# Altium schematic sheet Probe-Scope Power v1.0.SchDoc: Probe-Scope: Power
size Letter; CompanyName: Probe-Scope; Organization: Probe-Scope; Address1: Probe-Scope: Unified USB; Address2: Oscilloscope Probe; Address3: ©2019 M. Omo, J. Rowley,; Address4: K. Hall, released under the; SheetNumber: 6; PageSetup: Record=PageOptions|CenterHorizontal=True|CenterVertical=True|PrintScale=0.96|XCorrection=1.00|YCorrection=1.00|PrintKind=1|BorderSize=5000000|LeftOffset=0|BottomOffset=0|Orientation=2|PaperLength=1000|PaperWidth=1000|Scale=100|PaperSource=7|PrintQuality=-4|MediaType=1|DitherType=10|PaperKind=11x17|PrintScaleMode=1; License: CERN OHL v1.2
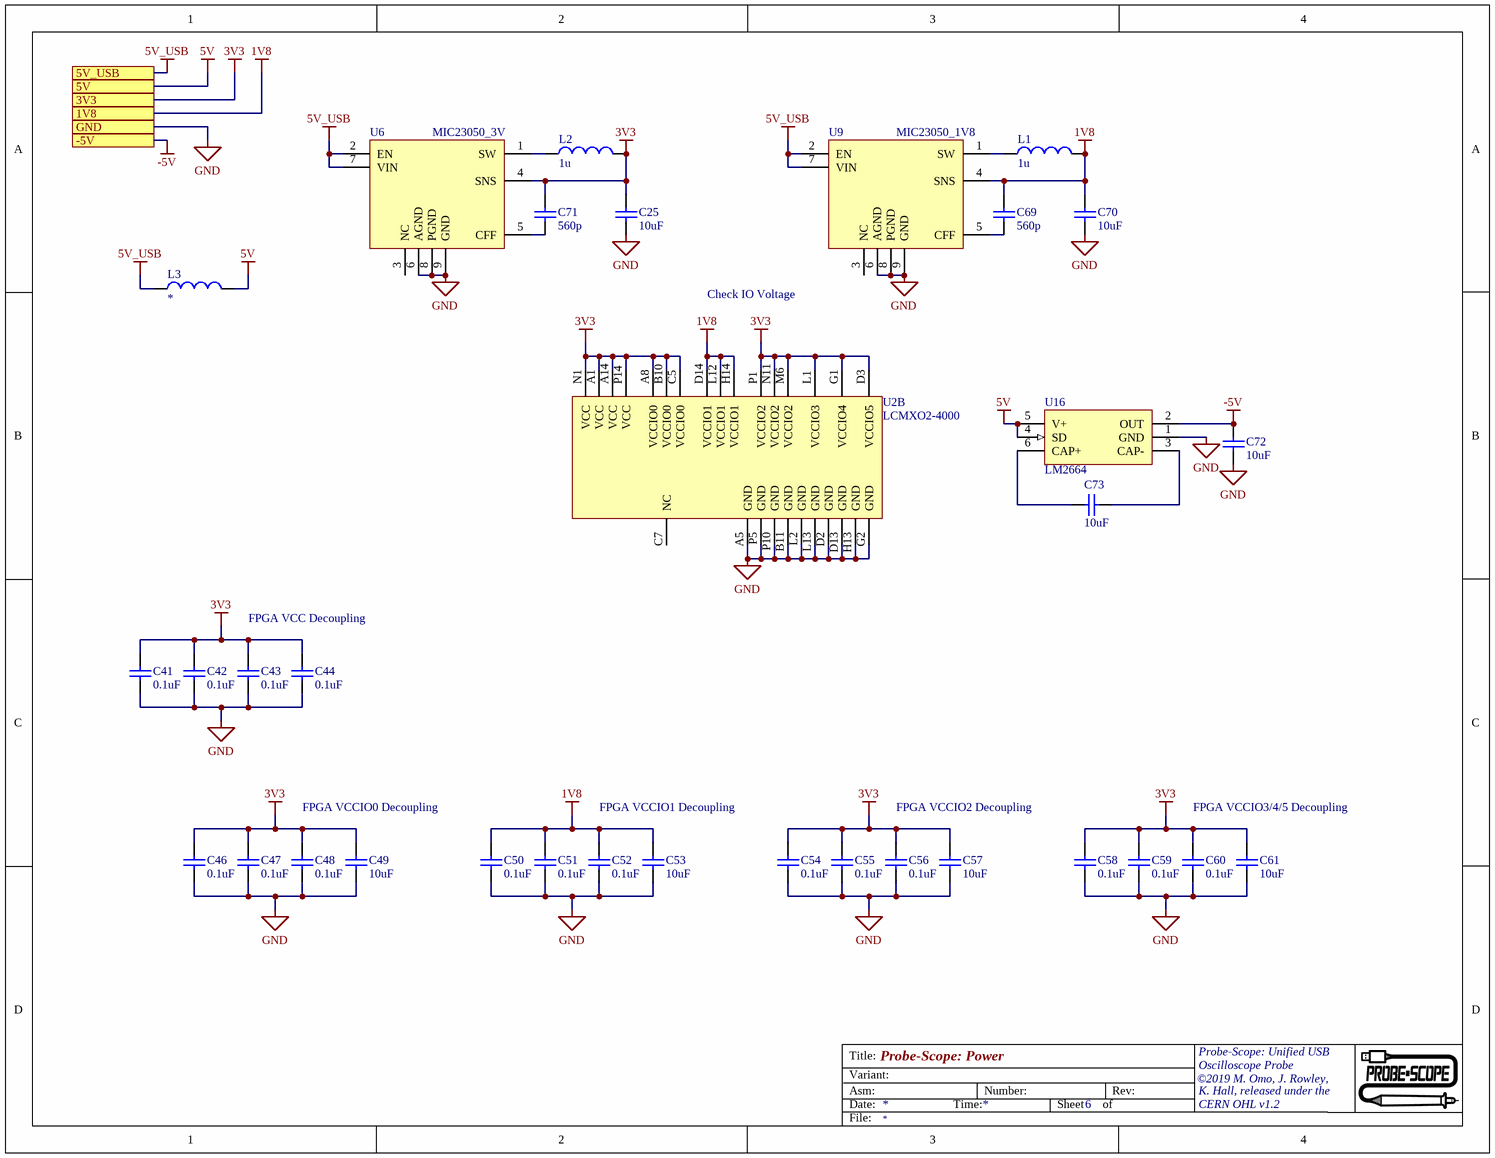
[diagram p0: Probe-Scope Power v1.0.SchDoc]

## Parts
C25  value 10uF  [0603(1608)]  (hidden comment: 25V)
C41  value 0.1uF  [0402(1005)]  (hidden comment: 6.3V)
C42  value 0.1uF  [0402(1005)]  (hidden comment: 6.3V)
C43  value 0.1uF  [0402(1005)]  (hidden comment: 6.3V)
C44  value 0.1uF  [0402(1005)]  (hidden comment: 6.3V)
C46  value 0.1uF  [0402(1005)]  (hidden comment: 6.3V)
C47  value 0.1uF  [0402(1005)]  (hidden comment: 6.3V)
C48  value 0.1uF  [0402(1005)]  (hidden comment: 6.3V)
C49  value 10uF  [0603(1608)]  (hidden comment: 25V)
C50  value 0.1uF  [0402(1005)]  (hidden comment: 6.3V)
C51  value 0.1uF  [0402(1005)]  (hidden comment: 6.3V)
C52  value 0.1uF  [0402(1005)]  (hidden comment: 6.3V)
C53  value 10uF  [0603(1608)]  (hidden comment: 25V)
C54  value 0.1uF  [0402(1005)]  (hidden comment: 6.3V)
C55  value 0.1uF  [0402(1005)]  (hidden comment: 6.3V)
C56  value 0.1uF  [0402(1005)]  (hidden comment: 6.3V)
C57  value 10uF  [0603(1608)]  (hidden comment: 25V)
C58  value 0.1uF  [0402(1005)]  (hidden comment: 6.3V)
C59  value 0.1uF  [0402(1005)]  (hidden comment: 6.3V)
C60  value 0.1uF  [0402(1005)]  (hidden comment: 6.3V)
C61  value 10uF  [0603(1608)]  (hidden comment: 25V)
C69  value 560p  [0402(1005)]  (hidden comment: Cap)
C70  value 10uF  [0603(1608)]  (hidden comment: 25V)
C71  value 560p  [0402(1005)]  (hidden comment: Cap)
C72  value 10uF  [0603(1608)]  (hidden comment: 25V)
C73  value 10uF  [0603(1608)]  (hidden comment: 25V)
L1  value 1u  [0603(1608)]  (hidden comment: Inductor)
L2  value 1u  [0603(1608)]  (hidden comment: Inductor)
L3  Ferrite Bead Y  [0805(2012)]  (value not drawn)
U2  LCMXO2-4000  [132_Ball_csBGA_MachXO2]  (part B of 5)
U6  MIC23050_3V  [MCP_8_MLF]
U9  MIC23050_1V8  [MCP_8_MLF]
U16  LM2664  [SOT95P280X145-6N]

## Ports
1V8, 3V3, 5V, 5V_USB, -5V, GND

## Nets
1V8: C50.2 C51.2 C52.2 C53.2 C69.2 C70.2 L1.2 U2.D14(VCCIO1) U2.H14(VCCIO1) U2.L12(VCCIO1) U9.4(SNS) ; port 1V8
3V3: C25.2 C41.2 C42.2 C43.2 C44.2 C46.2 C47.2 C48.2 C49.2 C54.2 C55.2 C56.2 C57.2 C58.2 C59.2 C60.2 C61.2 C71.2 L2.2 U2.A1(VCC) U2.A8(VCCIO0) U2.A14(VCC) U2.B10(VCCIO0) U2.C5(VCCIO0) U2.D3(VCCIO5) U2.G1(VCCIO4) U2.L1(VCCIO3) U2.M6(VCCIO2) U2.N1(VCC) U2.N11(VCCIO2) U2.P1(VCCIO2) U2.P14(VCC) U6.4(SNS) ; port 3V3
5V: L3.2 U16.4(SD) U16.5(V+) ; port 5V
5V_USB: L3.1 U6.2(EN) U6.7(VIN) U9.2(EN) U9.7(VIN) ; port 5V_USB
-5V: C72.2 U16.2(OUT) ; port -5V
GND: C25.1 C41.1 C42.1 C43.1 C44.1 C46.1 C47.1 C48.1 C49.1 C50.1 C51.1 C52.1 C53.1 C54.1 C55.1 C56.1 C57.1 C58.1 C59.1 C60.1 C61.1 C70.1 C72.1 U2.A5(GND) U2.B11(GND) U2.D2(GND) U2.D13(GND) U2.G2(GND) U2.H13(GND) U2.L2(GND) U2.L13(GND) U2.P5(GND) U2.P10(GND) U6.6(AGND) U6.8(PGND) U6.9(GND) U9.6(AGND) U9.8(PGND) U9.9(GND) U16.1(GND) ; port GND
NetC69_1: C69.1 U9.5(CFF)
NetC71_1: C71.1 U6.5(CFF)
NetC73_1: C73.1 U16.3(CAP-)
NetC73_2: C73.2 U16.6(CAP+)
NetL1_1: L1.1 U9.1(SW)
NetL2_1: L2.1 U6.1(SW)

Not connected (* = marked no-connect by the designer): U2 C7(NC); U6 3(NC); U9 3(NC)

## Notes on the sheet
- (near U9) Check IO Voltage
- FPGA VCC Decoupling
- FPGA VCCIO0 Decoupling
- FPGA VCCIO1 Decoupling
- FPGA VCCIO2 Decoupling
- FPGA VCCIO3/4/5 Decoupling
- Title:
- Asm:
- Date:
- Variant:
- Time:
- Number:
- Sheet
- of
- Rev:
- File:

## Library data of the parts
C25 C49 C53 C57 C61 C70 C72 C73 = 1306: Key: 1306; MENG_PN: ???1306; MANF: Samsung Electro-Mechanics; MANF_PN: CL10A106MA8NRNC; VENDOR: Digikey; VENDOR_PN: 1276-1869-1-ND; P&V Description: Capacitor, Ceramic, 10uF, 25V, 20% Tol, 85C, X5R, 0603, SMD; Class: Capacitor; Type: Ceramic; Other: X5R; Tolerance: 20; Voltage: 25; Max Temperature: 85; Approved: True; Package: 0603; SMD: True; Date Modified: 3/3/2015 11:08:29 AM; Modified By: sotterbacher; Parent Key: 1306; Verified: True
C41-C44 C46-C48 C50-C52 C54-C56 C58-C60 = 1875: Key: 1875; MENG_PN: ???1875; MANF: Samsung Electro-Mechanics; MANF_PN: CL05B104KQ5NNNC; VENDOR: Digikey; VENDOR_PN: 1276-1511-1-ND; P&V Description: Capacitor, Ceramic, 0.1uF, 6.3V, 10% Tol, 125C, X7R, 0402, SMD; Class: Capacitor; Type: Ceramic; Other: X7R; Tolerance: 10; Voltage: 6.3; Max Temperature: 125; Approved: False; Package: 0402; SMD: True; Date Modified: 11/6/2018 11:14:02 AM; Modified By: jrowley; Parent Key: 1875; Verified: False
C69 C71 = 2112: Key: 2112; MENG_PN: ???2112; MANF: Samsung Electro-Mechanics; MANF_PN: CL05B561KB5NNNC; VENDOR: Digikey; VENDOR_PN: 1276-1577-1-ND; P&V Description: Capacitor, Electrolytic, 560p, 50V, 10% Tol, 0402, SMD; Class: Capacitor; Type: Electrolytic; Tolerance: 10; Voltage: 50; Approved: False; Package: 0402; SMD: True; Date Modified: 7/11/2019 9:37:04 PM; Modified By: momo; Parent Key: 2112; Verified: False
L1 L2 = 2111: Key: 2111; MENG_PN: ???2111; MANF: Taiyo Yuden; MANF_PN: MCKK1608T1R0MN; VENDOR: Digikey; VENDOR_PN: 587-5973-1-ND; P&V Description: Inductor, Shielded, 1u, 1.3A, 0.123 Ohms, 0603, SMD; Type: Shielded; Tolerance: 20; Current: 1.3; DCR: 0.123; Approved: False; Class: Inductor; Package: 0603; SMD: True; Date Modified: 7/11/2019 9:33:48 PM; Modified By: momo; Parent Key: 2111; Verified: False
L3 = 323: Key: 323; MENG_PN: IND00006; MANF: TDK; MANF_PN: MMZ2012Y121B; VENDOR: Digikey; VENDOR_PN: 445-2196-1-ND; P&V Description: Inductor, Ferrite Bead, 0.8A, 120 Ohm at 100MHz, Effective from 80MHz To 400MHz, Y Material, 0805, SMD; Other: 120 Ohm at 100MHz, Effective from 80MHz To 400MHz, Y Material; Current: 0.8; Approved: True; Value: *; Class: Inductor; Type: Ferrite Bead; Package: 0805; SMD: True; Date Modified: 8/6/2009 8:13:58 AM; Modified By: pmarcus; Parent Key: 323; Verified: True
U2 = MachXO2-4000: MANF_PN: LCMXO2-4000HC-4MG132C; MANF: Lattice Semiconductor; VENDOR: DigiKey; VENDOR_PN: 220-1458-ND
U6 = MIC23050_3V: MANF: Microchip; MANF_PN: MIC23050-SYML-TR; VENDOR: Digikey; VENDOR_PN: 576-3351-1-ND
U9 = MIC23050_1V8: MANF: Microchip; MANF_PN: MIC23050-GYML-TR; VENDOR: Digikey; VENDOR_PN: 576-2974-1-ND
U16 = LM2664: MANF: Texas Instruments; MANF_PN: LM2664M6X/NOPB; VENDOR: DigiKey; VENDOR_PN: LM2664M6X/NOPBCT-ND